# Altium schematic sheet Power.SchDoc
size A; SheetNumber: 2; SheetTotal: 5
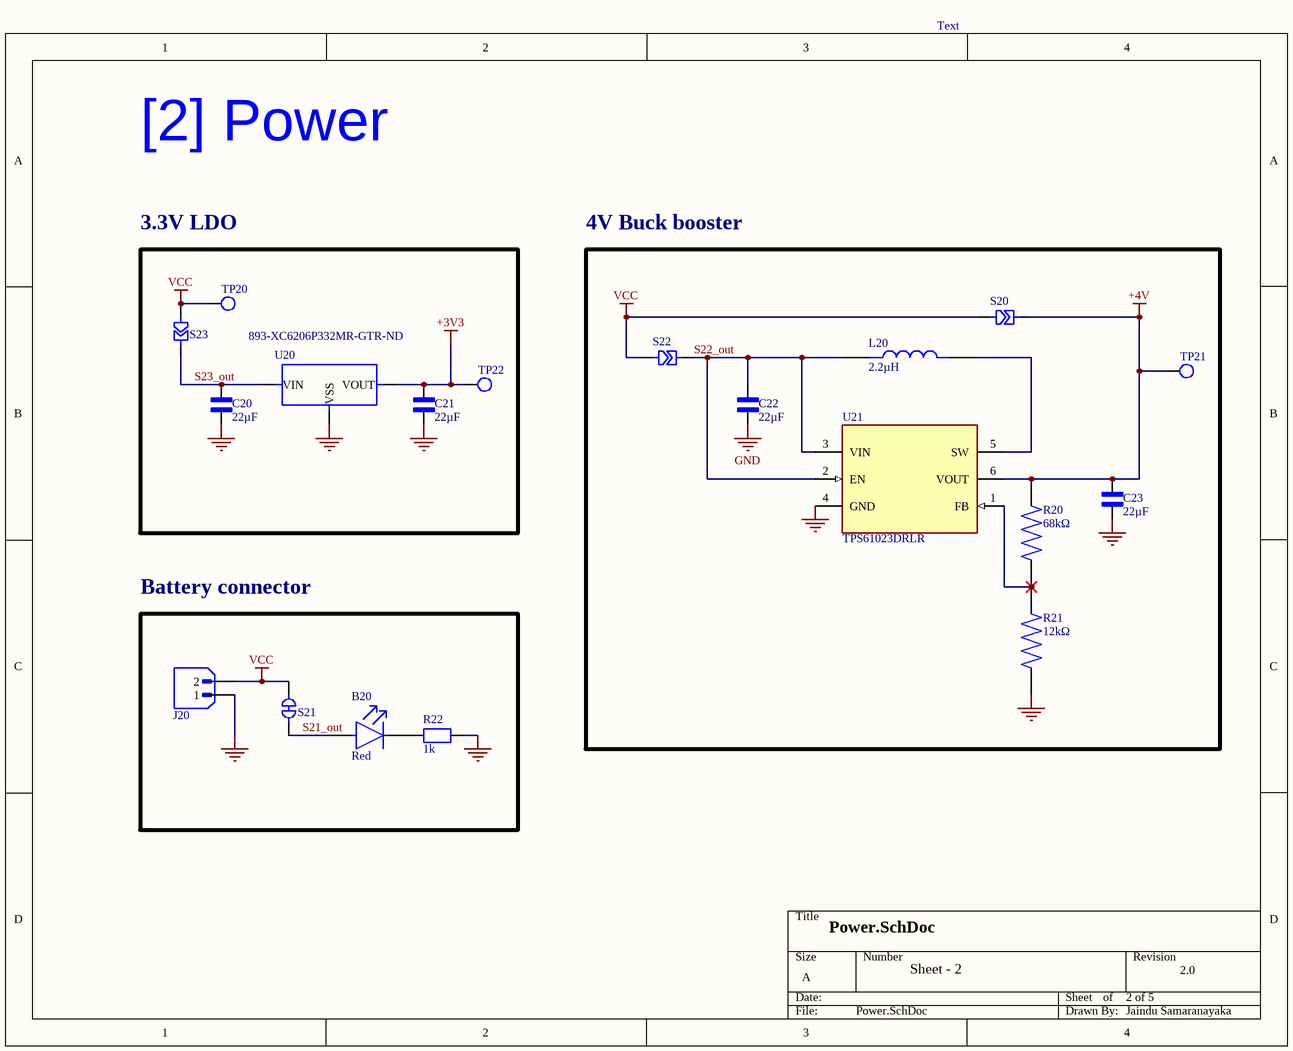
[diagram p0: Power.SchDoc]

## Parts
B20  Red  [FP-5988110107F-MFG]
C20  value 22µF  [CAPC3225X270N]  (hidden comment: 22uf)
C21  value 22µF  [CAPC3225X270N]  (hidden comment: 22uf)
C22  value 22µF  [CAPC3225X270N]  (hidden comment: 22uf)
C23  value 22µF  [CAPC3225X270N]  (hidden comment: 22uf)
J20  jst 2  [JST_B2B-XH-A]  (value not drawn)
L20  value 2.2µH  [IND_XFL4020-222MEC]  (hidden comment: 2.2uh)
R20  value 68kΩ  [RESC3216X70N]  (hidden comment: 68k)
R21  value 12kΩ  [RES_ERJPB6B1202V]  (hidden comment: 12k)
R22  1k  [RES_1206]
S20  Triangular SB  [Solder Bridge Triangular]  (value not drawn)
S21  Soldering Bridge close  [Circular jumper close]  (value not drawn)  (net tie, no BOM)
S22  Triangular SB  [Solder Bridge Triangular]  (value not drawn)
S23  Triangular SB  [Solder Bridge Triangular]  (value not drawn)
TP20  Test Pad  [Test Pad]  (value not drawn)
TP21  Test Pad  [Test Pad]  (value not drawn)
TP22  Test Pad  [Test Pad]  (value not drawn)
U20  Supplier Part Number: 893-XC6206P332MR-GTR-ND  [SOT-23]  (hidden comment: PMIC-LDO-XC6206P332MR-G(SOT23))
U21  TPS61023DRLR  [DRL0006A]

## Blocks framed on the sheet
3.3V LDO: C20 C21 S23 TP20 TP22 U20
4V Buck booster: C22 C23 L20 R20 R21 S20 S22 TP21 U21
Battery connector: B20 J20 R22 S21

## Nets
+3V3: C21.2 TP22.1 U20.2(VOUT)
+4V: C23.2 R20.2 S20.2 TP21.1 U21.6(VOUT)
GND: C20.1 C21.1 C22.1 C23.1 J20.1 R21.1 R22.1 U20.1(VSS) U21.4(GND)
VCC: J20.2 S20.1 S21.1 S22.1 S23.1 TP20.1
S21_out: B20.2(A) S21.2
S22_out: C22.2 L20.1 S22.2 U21.2(EN) U21.3(VIN)
S23_out: C20.2 S23.2 U20.3(VIN)
NetB20_1: B20.1(C) R22.2
NetL20_2: L20.2 U21.5(SW)
NetR20_1: R20.1 R21.2 U21.1(FB)

## Notes on the sheet
- Text
- [2] Power
- Sheet - 2
- 2 of 5
- 2.0
- Jaindu Samaranayaka

## Library data of the parts
B20 = CMP-00106-00868569-1: 598-8110-107F 598-8110-107F, Dialight, SMD LED 0805 Package, Red Single color SOLD IN INCREMENTS OF 4000. (REEL); NexarPartId: 868569; Wavelength: 635nm; Forward Current: 20mA; Lens Style: Clear; Forward Voltage: 2.2V; Power Dissipation: 60mW; Max Junction Temperature (Tj): 105°C; Luminous Intensity: 40mcd; Viewing Angle: 140°; Reverse Voltage: 5V; Number of LEDs: 1; Number of Pins: 2; Schedule B: 8541402000, 8541402000; Length: 2mm; Width: 1.25mm; Mount: Surface Mount; Height: 800µm; Case Code (Imperial): 0805; Case Code (Metric): 2012; RoHS: Compliant; Min Operating Temperature: -30°C; Color: Red; Case/Package: 0805; Depth: 1.25mm; Lead Free: Lead Free; Max Operating Temperature: 85°C; Test Current: 20mA; Illumination Color: Red; Number of Elements: 1; Dominant Wavelength: 635nm; REACH SVHC: No SVHC; Radiation Hardening: No
C20-C23 = CAPC3225X270N: 25V 22uF X7R 卤10% 1210 Multilayer Ceramic Capacitors MLCC - SMD/SMT ROHS; Manufacturer: Samsung Electro-Mechanics; Manufacturer Part Number: CL32B226KAJNNNE; Tolerance: 10%; Supplier: Future Electronics; Supplier Part Number: CL32B226KAJNNNE; RoHS: Compliant; Category: Ceramic Capacitors; Stock: 1822000; Pricing: 1000=0.106, 3000=0.103, 5000=0.102, 15000=0.0993, 25000=0.0969 (USD); Case/Package: 1210; Case Code (Imperial): 1210; Case Code (Metric): 3225; China RoHS: Compliant; Country of Origin: Mainland China, Philippines, South Korea; Depth: 2.5mm; Dielectric: X7R; Dielectric Material: Ceramic; Export Control Classification Number (ECCN) Code: EAR99; Height: 2.7mm; Harmonized Tariff Schedule (HTS) Code: 8532.24.00.20; Introduction Date: 2010-04-14; Lead Free: Lead Free; Length: 3.2mm; Lifecycle Status: Production; Material: Ceramic; Max Operating Temperature: 125°C; Min Operating Temperature: -55°C; Mounting Technology: Surface Mount; Number of Terminals: 2; Radiation Hardening: No; REACH SVHC: Yes; Schedule B: 8532240020, 8532240020|8532240020|8532240020|8532240020|8532240020|8532240020|8532240020|8532240020|8532240020|8532240020|8532240020|8532240020|8532240020|8532240020|8532240020|8532240020|8532240020|8532240020|8532240020|8532240020|8532240020|8532240020|8532240020|85; Thickness: 2.6924mm; Voltage Rating: 25V; Voltage Rating (DC): 25V; Width: 2.5mm; ComponentLink1URL: https://datasheet.octopart.com:443/CL32B226KAJNNNE-Samsung-Electro-Mechanics-datasheet-136482669.pdf?src-supplier=Newark; ComponentLink1Description: https://datasheet.octopart.com:443/CL32B226KAJNNNE-Samsung-Electro-Mechanics-datasheet-136482669.pdf?src-supplier=Newark; ComponentLink2URL: https://datasheet.octopart.com:443/CL32B226KAJNNNE-Samsung-Electro-Mechanics-datasheet-149049204.pdf?src-supplier=Future+Electronics; ComponentLink2Description: https://datasheet.octopart.com:443/CL32B226KAJNNNE-Samsung-Electro-Mechanics-datasheet-149049204.pdf?src-supplier=Future+Electronics; ComponentLink3URL: https://datasheet.octopart.com:443/CL32B226KAJNNNE-Samsung-Electro-Mechanics-datasheet-116051342.pdf?src-supplier=Future+Electronics; ComponentLink3Description: https://datasheet.octopart.com:443/CL32B226KAJNNNE-Samsung-Electro-Mechanics-datasheet-116051342.pdf?src-supplier=Future+Electronics; ComponentLink4URL: https://datasheet.octopart.com:443/CL32B226KAJNNNE-Samsung-Electro-Mechanics-datasheet-81462649.pdf?src-supplier=Future+Electronics; ComponentLink4Description: https://datasheet.octopart.com:443/CL32B226KAJNNNE-Samsung-Electro-Mechanics-datasheet-81462649.pdf?src-supplier=Future+Electronics; ComponentLink5URL: https://datasheet.octopart.com:443/CL32B226KAJNNNE-Samsung-datasheet-42485260.pdf?src-supplier=Future+Electronics; ComponentLink5Description: https://datasheet.octopart.com:443/CL32B226KAJNNNE-Samsung-datasheet-42485260.pdf?src-supplier=Future+Electronics; ComponentLink6URL: https://datasheet.octopart.com:443/CL32B226KAJNNNE-Samsung-datasheet-28848742.pdf?src-supplier=Future+Electronics; ComponentLink6Description: https://datasheet.octopart.com:443/CL32B226KAJNNNE-Samsung-datasheet-28848742.pdf?src-supplier=Future+Electronics; ComponentLink7URL: https://datasheet.octopart.com:443/CL32B226KAJNNNE-Samsung-datasheet-37081328.pdf?src-supplier=Future+Electronics; ComponentLink7Description: https://datasheet.octopart.com:443/CL32B226KAJNNNE-Samsung-datasheet-37081328.pdf?src-supplier=Future+Electronics; ComponentLink8URL: https://datasheet.octopart.com/CL32B226KAJNNNE-Samsung-Electro-Mechanics-datasheet-97040617.pdf; ComponentLink8Description: https://datasheet.octopart.com/CL32B226KAJNNNE-Samsung-Electro-Mechanics-datasheet-97040617.pdf; ComponentLink9URL: https://datasheet.octopart.com/CL32B226KAJNNNE-Samsung-Electro-Mechanics-datasheet-8324245.pdf; ComponentLink9Description: https://datasheet.octopart.com/CL32B226KAJNNNE-Samsung-Electro-Mechanics-datasheet-8324245.pdf; ComponentLink10URL: https://datasheet.octopart.com:443/CL32B226KAJNNNE-Samsung-datasheet-59220082.pdf?src-supplier=TME; ComponentLink10Description: https://datasheet.octopart.com:443/CL32B226KAJNNNE-Samsung-datasheet-59220082.pdf?src-supplier=TME
J20 = 2pin jst: CONNECTOR HEADER, XH SERIES, 2 POSITION, 2.50MM, Press-Fit Solder, Detent Lock, Natural; Manufacturer Part Number: B2B-XH-A(LF)(SN); Connector Type: Male Pin; Contact Resistance: 20mΩ; Current Rating: 3A; Gender: Male; Insulation Resistance: 1GΩ; Max Voltage Rating (AC): 250V; Number of Contacts: 2; Pitch: 2.5mm; Ratings: TUV; Wire/Cable Gauge: 22AWG; Supplier: Arrow Electronics; Supplier Part Number: B2B-XH-A(LF)(SN); Manufacturer: JST; RoHS: Compliant; Category: Headers and Wire Housings; Stock: 85075; Pricing: 1=0.0946, 10=0.0729, 25=0.0722, 100=0.0518, 500=0.05, 1000=0.0407 (USD); China RoHS: Compliant; Color: Natural, White; Contact Material: Copper, Tin; Contact Plating: Tin; Depth: 5.75mm; Fastening Type: Detent; Height: 7mm; Housing Color: White; Housing Material: Polyamide; Lead Free: Lead Free; Lead Pitch: 2.5mm; Length: 7.4mm; Lifecycle Status: Production; Max Current Rating: 3A; Max Operating Temperature: 85°C; Max Voltage Rating (DC): 250V; Min Operating Temperature: -25°C; Mounting Technology: Through Hole; Pins: 2; Number of Positions: 2; Number of Rows: 1; Orientation: Straight; REACH SVHC: Yes; Terminal Pitch: 2.5mm; Termination: Solder; Voltage Rating: 250V; Voltage Rating (AC): 250V; Weight: 28.349523g; Width: 6.35mm; ComponentLink1URL: https://datasheet.octopart.com:443/B2B-XH-A%28LF%29%28SN%29-JST-datasheet-12510042.pdf?src-supplier=Newark; ComponentLink1Description: https://datasheet.octopart.com:443/B2B-XH-A%28LF%29%28SN%29-JST-datasheet-12510042.pdf?src-supplier=Newark; ComponentLink2URL: https://datasheet.octopart.com:443/B2B-XH-A-%28LF%29%28SN%29-JST-datasheet-41261050.pdf?src-supplier=Newark; ComponentLink2Description: https://datasheet.octopart.com:443/B2B-XH-A-%28LF%29%28SN%29-JST-datasheet-41261050.pdf?src-supplier=Newark; ComponentLink3URL: https://datasheet.octopart.com:443/B2B-XH-A%28LF%29%28SN%29-JST-datasheet-63094.pdf?src-supplier=Upverter; ComponentLink3Description: https://datasheet.octopart.com:443/B2B-XH-A%28LF%29%28SN%29-JST-datasheet-63094.pdf?src-supplier=Upverter; ComponentLink4URL: https://datasheet.octopart.com:443/B2B-XH-A%28LF%29%28SN%29-JST-datasheet-8325564.pdf?src-supplier=Burklin+Elektronik; ComponentLink4Description: https://datasheet.octopart.com:443/B2B-XH-A%28LF%29%28SN%29-JST-datasheet-8325564.pdf?src-supplier=Burklin+Elektronik; ComponentLink5URL: https://datasheet.octopart.com:443/B2B-XH-A%28LF%29%28SN%29-JST-datasheet-138896056.pdf?src-supplier=IHS; ComponentLink5Description: https://datasheet.octopart.com:443/B2B-XH-A%28LF%29%28SN%29-JST-datasheet-138896056.pdf?src-supplier=IHS; ComponentLink6URL: https://datasheet.octopart.com:443/B2B-XH-A-%28LF%29%28SN%29-JST-datasheet-62336360.pdf?src-supplier=element14+APAC; ComponentLink6Description: https://datasheet.octopart.com:443/B2B-XH-A-%28LF%29%28SN%29-JST-datasheet-62336360.pdf?src-supplier=element14+APAC; ComponentLink7URL: https://datasheet.octopart.com:443/B2B-XH-A%28LF%29%28SN%29-JST-datasheet-10026044.pdf?src-supplier=TME; ComponentLink7Description: https://datasheet.octopart.com:443/B2B-XH-A%28LF%29%28SN%29-JST-datasheet-10026044.pdf?src-supplier=TME; ComponentLink8URL: https://datasheet.octopart.com:443/B2B-XH-A%28LF%29%28SN%29-JST-datasheet-140264791.pdf?src-supplier=LKR; ComponentLink8Description: https://datasheet.octopart.com:443/B2B-XH-A%28LF%29%28SN%29-JST-datasheet-140264791.pdf?src-supplier=LKR; ComponentLink9URL: https://datasheet.octopart.com:443/B2B-XH-A%28LF%29%28SN%29-JST-datasheet-157850277.pdf?src-supplier=Amar+Radio+Corporation; ComponentLink9Description: https://datasheet.octopart.com:443/B2B-XH-A%28LF%29%28SN%29-JST-datasheet-157850277.pdf?src-supplier=Amar+Radio+Corporation
L20 = XFL4020-222MEC: Inductor Power Shielded Wirewound 2.2uH 20% 1MHz 8A 0.0235Ohm DCR 1515 Automotive T/R; Manufacturer: Coilcraft; Core Material: Composite; DC Resistance (DCR): 23.5mΩ; Number of Circuits: 1; Saturation Current: 3.1A; Self Resonant Frequency: 38MHz; Supplier: Farnell; Supplier Part Number: XFL4020-222MEC; Manufacturer Part Number: XFL4020-222MEC; RoHS: Compliant; Category: Fixed Inductors; Stock: 19584; Pricing: 1=1.97, 50=1.4, 100=1.04, 250=1.02, 500=0.955, 1000=0.895 (GBP); Ambient Temperature Range High: 125°C; Case/Package: 1616; China RoHS: Compliant; Height: 2.1mm; Inductance Tolerance: 20%; Lead Free: Contains Lead; Length: 4mm; Lifecycle Status: Production; Max Current Rating: 8A; Max DC Current: 8A; Max Operating Temperature: 125°C; Min Operating Temperature: -40°C; Mounting Technology: Surface Mount; Number of Terminals: 2; Packaging: Cut Tape; Ratings: AEC-Q200; REACH SVHC: Yes; RMS Current (Irms): 8A; ESR: 23.5mΩ; Shielding: Shielded; Termination: SMD/SMT; Test Frequency: 1MHz; Tolerance: 20%; Width: 4mm; ComponentLink1URL: https://datasheet.octopart.com:443/XFL4020-222MEC-Coilcraft-datasheet-180122279.pdf?src-supplier=IHS; ComponentLink1Description: https://datasheet.octopart.com:443/XFL4020-222MEC-Coilcraft-datasheet-180122279.pdf?src-supplier=IHS; ComponentLink2URL: https://datasheet.octopart.com:443/XFL4020-222MEC-Coilcraft-datasheet-10792328.pdf?src-supplier=Coilcraft+Direct; ComponentLink2Description: https://datasheet.octopart.com:443/XFL4020-222MEC-Coilcraft-datasheet-10792328.pdf?src-supplier=Coilcraft+Direct; ComponentLink3URL: https://datasheet.octopart.com:443/XFL4020-222MEC-Coilcraft-datasheet-14354401.pdf?src-supplier=Newark; ComponentLink3Description: https://datasheet.octopart.com:443/XFL4020-222MEC-Coilcraft-datasheet-14354401.pdf?src-supplier=Newark
R20 = RK73H2BTTD6802F: Res Thick Film 1206 68K Ohm 1% 0.25W(1/4W) ±100ppm/C Pad SMD T/R Automotive AEC-Q200; Manufacturer: KOA Speer; Power Rating: 250mW; Temperature Coefficient: 100ppm/°C; Voltage Rating: 200V; Supplier: Arrow Electronics; Supplier Part Number: RK73H2BTTD6802F; Manufacturer Part Number: RK73H2BTTD6802F; RoHS: Compliant; Category: Chip SMD Resistors; Stock: 10000; Pricing: 10000=0.0041 (USD); Case/Package: 1206; Case Code (Imperial): 1206; Case Code (Metric): 3216; China RoHS: Non-Compliant; Composition: Thick Film; Country of Origin: Japan; Export Control Classification Number (ECCN) Code: EAR99; Height: 600µm; Harmonized Tariff Schedule (HTS) Code: 8533.21.00.30; Introduction Date: 2002-06-01; Lead Free: Lead Free; Length: 3.2mm; Lifecycle Status: Production; Max Operating Temperature: 155°C; Min Operating Temperature: -55°C; Mounting Technology: Surface Mount; Pins: 2; Number of Terminals: 2; Ratings: AEC-Q200; REACH SVHC: Yes; Schedule B: 8533210045; Termination: SMD/SMT; Tolerance: 1%; Width: 1.6mm; Working Voltage: 200V; ComponentLink1URL: https://datasheet.octopart.com:443/RK73H2BTTD6802F-KOA-Speer-datasheet-181956035.pdf?src-supplier=IHS; ComponentLink1Description: https://datasheet.octopart.com:443/RK73H2BTTD6802F-KOA-Speer-datasheet-181956035.pdf?src-supplier=IHS; ComponentLink2URL: https://datasheet.octopart.com:443/RK73H2BTTD6802F-KOA-Speer-datasheet-11590619.pdf?src-supplier=Upverter; ComponentLink2Description: https://datasheet.octopart.com:443/RK73H2BTTD6802F-KOA-Speer-datasheet-11590619.pdf?src-supplier=Upverter; ComponentLink3URL: https://datasheet.octopart.com:443/RK73H2BTTD6802F-KOA-Speer-datasheet-149653815.pdf?src-supplier=Newark; ComponentLink3Description: https://datasheet.octopart.com:443/RK73H2BTTD6802F-KOA-Speer-datasheet-149653815.pdf?src-supplier=Newark; ComponentLink4URL: https://datasheet.octopart.com:443/RK73H2BTTD6802F-KOA-Speer-datasheet-155997623.pdf?src-supplier=Future+Electronics; ComponentLink4Description: https://datasheet.octopart.com:443/RK73H2BTTD6802F-KOA-Speer-datasheet-155997623.pdf?src-supplier=Future+Electronics; ComponentLink5URL: https://datasheet.octopart.com/RK73H-%7C-Flat-Chip-Resistors-%28Precision-Grade%29-KOA-Speer-datasheet-family-85.pdf; ComponentLink5Description: https://datasheet.octopart.com/RK73H-%7C-Flat-Chip-Resistors-%28Precision-Grade%29-KOA-Speer-datasheet-family-85.pdf; ComponentLink6URL: https://datasheet.octopart.com:443/RK73H2BTTD6802F-KOA-Speer-datasheet-10854116.pdf?src-supplier=element14+APAC; ComponentLink6Description: https://datasheet.octopart.com:443/RK73H2BTTD6802F-KOA-Speer-datasheet-10854116.pdf?src-supplier=element14+APAC; ComponentLink7URL: http://sigma.octopart.com:80/rohs_certificate/RK73H-%7C-Flat-Chip-Resistors-%28Precision-Grade%29-KOA-Speer-family-91.pdf?src-supplier=Compliance+Statements; ComponentLink7Description: http://sigma.octopart.com:80/rohs_certificate/RK73H-%7C-Flat-Chip-Resistors-%28Precision-Grade%29-KOA-Speer-family-91.pdf?src-supplier=Compliance+Statements
R21 = ERJPB6B1202V: Res Thick Film 0805 12K Ohm 0.1% 0.25W(1/4W) ±50ppm/C Pad SMD Automotive T/R; Manufacturer: ROHM; Manufacturer Part Number: ESR10EZPJ123; Manufacturer Lifecycle Status: ACTIVE; Part Series: High Precision Thick Film Chip Resistors; Max Power Dissipation: 400mW; Ratings: AEC-Q200, IATF 16949; Temperature Coefficient: 200ppm/°C; Tolerance: 5%; Voltage Rating: 150V; Voltage Rating (DC): 15V; Supplier: DigiKey; Supplier Part Number: RHM12KKTR-ND; RoHS: Compliant; Category: Chip SMD Resistors; Stock: 10000; Pricing: 5000=0.01519, 10000=0.01291 (USD); Case/Package: 0805; Case Code (Imperial): 0805; Case Code (Metric): 2012; Composition: Thick Film; Contact Plating: Tin; Features: Automotive AEC-Q200; Height: 550µm; Lead Free: Lead Free; Length: 2mm; Lifecycle Status: Production; Max Operating Temperature: 155°C; Min Operating Temperature: -55°C; Mounting Technology: Surface Mount; Number of Terminals: 2; Number of Terminations: 2; Power Rating: 400mW; REACH SVHC: Yes; Width: 1.25mm; Working Voltage: 150V; ComponentLink1URL: https://datasheet.octopart.com:443/ESR10EZPJ123-ROHM-datasheet-182147623.pdf?src-supplier=IHS; ComponentLink1Description: https://datasheet.octopart.com:443/ESR10EZPJ123-ROHM-datasheet-182147623.pdf?src-supplier=IHS; ComponentLink2URL: https://datasheet.octopart.com:443/ESR10EZPJ123-Rohm-datasheet-80324120.pdf?src-supplier=Future+Electronics; ComponentLink2Description: https://datasheet.octopart.com:443/ESR10EZPJ123-Rohm-datasheet-80324120.pdf?src-supplier=Future+Electronics; ComponentLink3URL: https://datasheet.octopart.com:443/ESR10EZPJ123-Rohm-datasheet-68299596.pdf?src-supplier=Future+Electronics; ComponentLink3Description: https://datasheet.octopart.com:443/ESR10EZPJ123-Rohm-datasheet-68299596.pdf?src-supplier=Future+Electronics; ComponentLink4URL: https://datasheet.octopart.com:443/ESR10EZPJ123-Rohm-datasheet-8327111.pdf?src-supplier=_legacy+Avnet; ComponentLink4Description: https://datasheet.octopart.com:443/ESR10EZPJ123-Rohm-datasheet-8327111.pdf?src-supplier=_legacy+Avnet; China RoHS: Non-Compliant; Country of Origin: Mainland China, Philippines, South Korea; Export Control Classification Number (ECCN) Code: EAR99; Harmonized Tariff Schedule (HTS) Code: 8533.21.00.30; Introduction Date: 2015-05-13; Thickness: 130µm; ComponentLink5URL: https://datasheet.octopart.com:443/RC0402F123CS-Samsung-Electro-Mechanics-datasheet-141348306.pdf?src-supplier=IHS; ComponentLink5Description: https://datasheet.octopart.com:443/RC0402F123CS-Samsung-Electro-Mechanics-datasheet-141348306.pdf?src-supplier=IHS; ComponentLink6URL: https://datasheet.octopart.com/RC0402F123CS-Samsung-Electro-Mechanics-datasheet-41960856.pdf; ComponentLink6Description: https://datasheet.octopart.com/RC0402F123CS-Samsung-Electro-Mechanics-datasheet-41960856.pdf; Height - Seated (Max): 711.2µm; Packaging: Tape & Reel; Schedule B: 8533210045; ComponentLink7URL: https://datasheet.octopart.com:443/ERJPB6B1202V-Panasonic-datasheet-182147307.pdf?src-supplier=IHS; ComponentLink7Description: https://datasheet.octopart.com:443/ERJPB6B1202V-Panasonic-datasheet-182147307.pdf?src-supplier=IHS; ComponentLink8URL: https://datasheet.octopart.com:443/ERJPB6B1202V-Panasonic-datasheet-82522998.pdf?src-supplier=Panasonic; ComponentLink8Description: https://datasheet.octopart.com:443/ERJPB6B1202V-Panasonic-datasheet-82522998.pdf?src-supplier=Panasonic; ComponentLink9URL: https://datasheet.octopart.com:443/ERJPB6B1202V-Panasonic-datasheet-136610817.pdf?src-supplier=Newark; ComponentLink9Description: https://datasheet.octopart.com:443/ERJPB6B1202V-Panasonic-datasheet-136610817.pdf?src-supplier=Newark; ComponentLink10URL: https://sigma.octopart.com:443/150570796/technical_drawing/Panasonic-ERJPB6B1202V.pdf?src-supplier=Panasonic+SCT; ComponentLink10Description: https://sigma.octopart.com:443/150570796/technical_drawing/Panasonic-ERJPB6B1202V.pdf?src-supplier=Panasonic+SCT; ComponentLink11URL: https://datasheet.octopart.com:443/ERJPB6B1202V-Panasonic-datasheet-177212511.pdf?src-supplier=Burklin+Elektronik; ComponentLink11Description: https://datasheet.octopart.com:443/ERJPB6B1202V-Panasonic-datasheet-177212511.pdf?src-supplier=Burklin+Elektronik
R22 = RES_1206: SMD 3.2mm × 1.6mm size resistor (1206); Manufacturer: *; Manufacturer part number: *
S20 S22 S23 = Triangular SB: Solder Bridge triangular closed
S21 = Soldering Bridge close: Soldering Bridge close SMD
U20 = PMIC-LDO-XC6206P332MR-G(SOT23): 3¦ÌA Fixed 200mA 1 3.3V 1.8V 3.3V 6V 680mV@ 100mA 60mV 0.25%/V SOT-23 , 2.9mm*1.6mm*1.3mm; Manufacturer: Torex; Number of Channels: 1; Voltage Tolerance: 2%; Supplier: DigiKey; Manufacturer Part Number: XC6206P332MR-G; RoHS: Compliant; Category: LDO Voltage Regulators; Stock: 3000; Pricing: 3000=0.24092, 6000=0.23453, 9000=0.23133, 15000=0.22778, 21000=0.22571, 30000=0.22371 (USD); Case/Package: LSSOP; Height - Seated (Max): 1.3mm; Length: 2.9mm; Lifecycle Status: Production; Max Supply Voltage: 6V; Max Operating Temperature: 85°C; Min Input Voltage: 1.8V; Min Operating Temperature: -40°C; Number of Circuits: 1; Number of Outputs: 1; Number of Terminals: 3; Output Voltage: 3.3V; REACH SVHC: Yes; Terminal Pitch: 950µm; Width: 1.6mm; ComponentLink1URL: https://datasheet.octopart.com:443/XC6206P332MR-G-Torex-datasheet-181386674.pdf?src-supplier=IHS; ComponentLink1Description: https://datasheet.octopart.com:443/XC6206P332MR-G-Torex-datasheet-181386674.pdf?src-supplier=IHS; ComponentLink2URL: https://datasheet.octopart.com:443/XC6206P332MR-G-Torex-datasheet-134531119.pdf?src-supplier=TME; ComponentLink2Description: https://datasheet.octopart.com:443/XC6206P332MR-G-Torex-datasheet-134531119.pdf?src-supplier=TME; ComponentLink3URL: https://datasheet.octopart.com:443/XC6206P332MR-G-Torex-datasheet-62046785.pdf?src-supplier=SHENGYU+ELECTRONICS; ComponentLink3Description: https://datasheet.octopart.com:443/XC6206P332MR-G-Torex-datasheet-62046785.pdf?src-supplier=SHENGYU+ELECTRONICS; ComponentLink4URL: https://datasheet.octopart.com:443/XC6206P332MR-G-Torex-datasheet-30458793.pdf?src-supplier=Seeed+Studio; ComponentLink4Description: https://datasheet.octopart.com:443/XC6206P332MR-G-Torex-datasheet-30458793.pdf?src-supplier=Seeed+Studio
U21 = TPS61023DRLR: Switching Voltage Regulators 3.7-A boost converter with 0.5-V ultra-low input vo; Manufacturer: Texas Instruments; Manufacturer Lifecycle Status: ACTIVE; Max Duty Cycle: 97%; Max Junction Temperature (Tj): 125°C; Max Supply Voltage: 5.5V; Min Supply Voltage: 500mV; Nominal Supply Current: 900nA; Number of Channels: 1; Output Current: 3.7A; Supplier: DigiKey; Supplier Part Number: 296-TPS61023DRLRTR-ND; RoHS: Compliant; Category: Voltage Regulators - Switching; Stock: 28000; Pricing: 4000=0.52619, 8000=0.5149, 12000=0.50924 (USD); Height: 600µm; Length: 1.6mm; Lifecycle Status: Production; Max Operating Temperature: 125°C; Min Operating Temperature: -40°C; Number of Outputs: 1; Pins: 6; Thickness: 550µm; Topology: Boost; Width: 1.2mm; ComponentLink1URL: https://sigma.octopart.com:443/181443429/technical_drawing/Texas-Instruments-TPS61023DRLR.pdf?src-supplier=Texas+Instruments; ComponentLink1Description: https://sigma.octopart.com:443/181443429/technical_drawing/Texas-Instruments-TPS61023DRLR.pdf?src-supplier=Texas+Instruments; ComponentLink2URL: https://octopart.com:443/opatz8j6/c1?t=zyOQleeQE8oLSqcAalxdDo3IzngUSb6qW0xoQPFG-OpktvE5sTVhc_u5fgw44jO42BG8o5NLEr2IGCXOilT0ZzZHi8hsfSP8-jfyobuhC8rJog1zy9Po-Mu1Eb699a1TRS2F6YKZGmVxF-MtZwjJGnSs2XBC4L7unR9MEC2OSL8jXNufOWy_70nkXFNc1gPN9bE1BWKJqJdrvkSolJDOb8_OgdP1gf8ZhoZciT4xsMx_e2aPeWGIPyMYnWe1iSdwtP4F6JoCEMvN7e2Kj02C4lo69w7tRubE0ZsGNY9dLxO3XYZKWIKxeoh7nQ82TQOfq_fUKCDCci_4ewscxq_iqWwwYrdWznK4hJhrMZFNlos7TSPV0WhLN2_pC5NqraIp5JHG1eUs1Q&src-supplier=Texas+Instruments; ComponentLink2Description: https://octopart.com:443/opatz8j6/c1?t=zyOQleeQE8oLSqcAalxdDo3IzngUSb6qW0xoQPFG-OpktvE5sTVhc_u5fgw44jO42BG8o5NLEr2IGCXOilT0ZzZHi8hsfSP8-jfyobuhC8rJog1zy9Po-Mu1Eb699a1TRS2F6YKZGmVxF-MtZwjJGnSs2XBC4L7unR9MEC2OSL8jXNufOWy_70nkXFNc1gPN9bE1BWKJqJdrvkSolJDOb8_OgdP1gf8ZhoZciT4xsMx_e2aPeWGIPyMYnWe1iSdwtP4F6JoCEMvN7e2Kj02C4lo69w7tRubE0ZsGNY9dLxO3XYZKWIKxeoh7nQ82TQOfq_fUKCDCci_4ewscxq_iqWwwYrdWznK4hJhrMZFNlos7TSPV0WhLN2_pC5NqraIp5JHG1eUs1Q&src-supplier=Texas+Instruments; ComponentLink3URL: https://sigma.octopart.com:443/179311942/technical_drawing/Texas-Instruments-TPS61023DRLR.pdf?src-supplier=Texas+Instruments; ComponentLink3Description: https://sigma.octopart.com:443/179311942/technical_drawing/Texas-Instruments-TPS61023DRLR.pdf?src-supplier=Texas+Instruments; ComponentLink4URL: https://sigma.octopart.com:443/158890725/technical_drawing/Texas-Instruments-TPS61023DRLR.pdf?src-supplier=Texas+Instruments; ComponentLink4Description: https://sigma.octopart.com:443/158890725/technical_drawing/Texas-Instruments-TPS61023DRLR.pdf?src-supplier=Texas+Instruments; ComponentLink5URL: https://sigma.octopart.com:443/149978429/technical_drawing/Texas-Instruments-TPS61023DRLR.pdf?src-supplier=Texas+Instruments; ComponentLink5Description: https://sigma.octopart.com:443/149978429/technical_drawing/Texas-Instruments-TPS61023DRLR.pdf?src-supplier=Texas+Instruments; ComponentLink6URL: https://datasheet.octopart.com:443/TPS61023DRLR-Texas-Instruments-datasheet-152518939.pdf?src-supplier=Upverter; ComponentLink6Description: https://datasheet.octopart.com:443/TPS61023DRLR-Texas-Instruments-datasheet-152518939.pdf?src-supplier=Upverter; ComponentLink7URL: https://datasheet.octopart.com:443/TPS61023DRLR-Texas-Instruments-datasheet-182474952.pdf?src-supplier=LCSC; ComponentLink7Description: https://datasheet.octopart.com:443/TPS61023DRLR-Texas-Instruments-datasheet-182474952.pdf?src-supplier=LCSC; ComponentLink8URL: https://datasheet.octopart.com:443/TPS61023DRLR-Texas-Instruments-datasheet-163726964.pdf?src-supplier=LCSC; ComponentLink8Description: https://datasheet.octopart.com:443/TPS61023DRLR-Texas-Instruments-datasheet-163726964.pdf?src-supplier=LCSC; ComponentLink9URL: http://sigma.octopart.com:80/reach_statement/Texas-Instruments-company-64.pdf?src-supplier=Compliance+Statements; ComponentLink9Description: http://sigma.octopart.com:80/reach_statement/Texas-Instruments-company-64.pdf?src-supplier=Compliance+Statements; ComponentLink10URL: http://sigma.octopart.com:80/conflict_mineral_statement/Texas-Instruments-company-63.pdf?src-supplier=Compliance+Statements; ComponentLink10Description: http://sigma.octopart.com:80/conflict_mineral_statement/Texas-Instruments-company-63.pdf?src-supplier=Compliance+Statements; Manufacturer Part Number: TPS61023DRLR